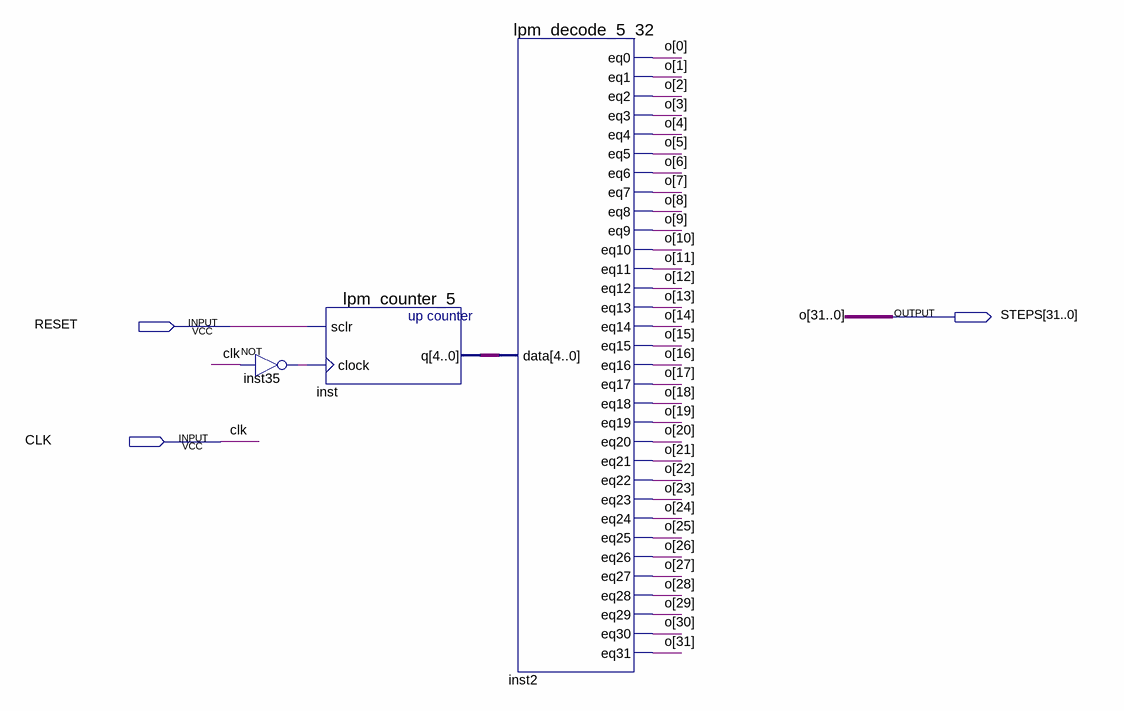
[diagram p0: schematic sheet]
// Quartus schematic stairway_noclk.bdf as structural Verilog: 3 symbols, 3 pins
module stairway_noclk (
  input  RESET,
  input  CLK,
  output [31:0] STEPS
);

  wire inst35_out;
  wire [4:0] inst_q;

  not inst35 (inst35_out, CLK);
  lpm_counter_5 inst (.sclr(RESET), .clock(inst35_out), .q(inst_q));
  lpm_decode_5_32 inst2 (
    .data(inst_q), .eq0(STEPS[0]), .eq1(STEPS[1]), .eq2(STEPS[2]), .eq3(STEPS[3]), .eq4(STEPS[4]),
    .eq5(STEPS[5]), .eq6(STEPS[6]), .eq7(STEPS[7]), .eq8(STEPS[8]), .eq9(STEPS[9]), .eq10(STEPS[10]),
    .eq11(STEPS[11]), .eq12(STEPS[12]), .eq13(STEPS[13]), .eq14(STEPS[14]), .eq15(STEPS[15]),
    .eq16(STEPS[16]), .eq17(STEPS[17]), .eq18(STEPS[18]), .eq19(STEPS[19]), .eq20(STEPS[20]),
    .eq21(STEPS[21]), .eq22(STEPS[22]), .eq23(STEPS[23]), .eq24(STEPS[24]), .eq25(STEPS[25]),
    .eq26(STEPS[26]), .eq27(STEPS[27]), .eq28(STEPS[28]), .eq29(STEPS[29]), .eq30(STEPS[30]), .eq31(STEPS[31]));

  // Other names for the same wires on the sheet: o[31:0] = STEPS
endmodule
